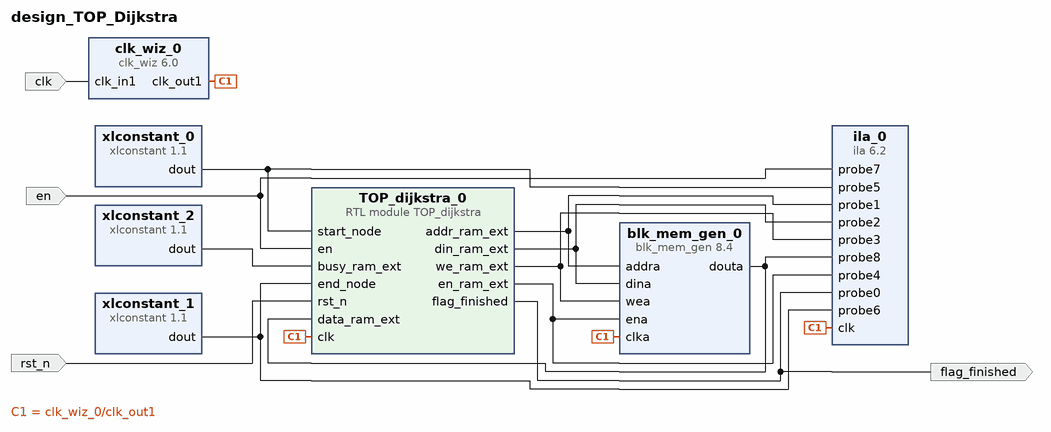
[diagram p0: block diagram of the top level]
# Vivado block design design_TOP_Dijkstra, xc7z020clg400-1, Vivado 2020.2
create_bd_design design_TOP_Dijkstra

create_bd_port -dir I -type clk clk
create_bd_port -dir I en
create_bd_port -dir O flag_finished
create_bd_port -dir I -type rst rst_n

create_bd_cell -type ip -vlnv xilinx.com:ip:blk_mem_gen:8.4 blk_mem_gen_0
set_property -dict [list \
  CONFIG.Enable_32bit_Address false \
  CONFIG.Memory_Type Single_Port_RAM \
  CONFIG.Operating_Mode_A NO_CHANGE \
  CONFIG.Port_A_Write_Rate 50 \
  CONFIG.Port_B_Clock 0 \
  CONFIG.Port_B_Enable_Rate 0 \
  CONFIG.Read_Width_A 16 \
  CONFIG.Register_PortA_Output_of_Memory_Primitives true \
  CONFIG.Use_Byte_Write_Enable false \
  CONFIG.Use_RSTA_Pin false \
  CONFIG.Write_Depth_A 256 \
  CONFIG.Write_Width_A 16 \
  CONFIG.use_bram_block Stand_Alone \
] [get_bd_cells blk_mem_gen_0]
create_bd_cell -type ip -vlnv xilinx.com:ip:xlconstant:1.1 xlconstant_0
set_property -dict {CONFIG.CONST_VAL 1 CONFIG.CONST_WIDTH 5} [get_bd_cells xlconstant_0]
create_bd_cell -type ip -vlnv xilinx.com:ip:xlconstant:1.1 xlconstant_1
set_property -dict {CONFIG.CONST_VAL 17 CONFIG.CONST_WIDTH 5} [get_bd_cells xlconstant_1]
create_bd_cell -type ip -vlnv xilinx.com:ip:ila:6.2 ila_0
set_property -dict [list \
  CONFIG.C_ENABLE_ILA_AXI_MON false \
  CONFIG.C_MONITOR_TYPE Native \
  CONFIG.C_NUM_OF_PROBES 9 \
  CONFIG.C_PROBE5_WIDTH 5 \
  CONFIG.C_PROBE6_WIDTH 5 \
  CONFIG.C_PROBE8_WIDTH 16 \
] [get_bd_cells ila_0]
create_bd_cell -type ip -vlnv xilinx.com:ip:xlconstant:1.1 xlconstant_2
set_property -dict {CONFIG.CONST_VAL 0 CONFIG.CONST_WIDTH 1} [get_bd_cells xlconstant_2]
create_bd_cell -type ip -vlnv xilinx.com:ip:clk_wiz:6.0 clk_wiz_0
set_property -dict [list \
  CONFIG.CLKOUT1_DRIVES BUFG \
  CONFIG.CLKOUT1_JITTER 203.457 \
  CONFIG.CLKOUT1_PHASE_ERROR 155.540 \
  CONFIG.CLKOUT1_REQUESTED_OUT_FREQ 50 \
  CONFIG.CLKOUT2_DRIVES BUFG \
  CONFIG.CLKOUT3_DRIVES BUFG \
  CONFIG.CLKOUT4_DRIVES BUFG \
  CONFIG.CLKOUT5_DRIVES BUFG \
  CONFIG.CLKOUT6_DRIVES BUFG \
  CONFIG.CLKOUT7_DRIVES BUFG \
  CONFIG.JITTER_SEL No_Jitter \
  CONFIG.MMCM_BANDWIDTH OPTIMIZED \
  CONFIG.MMCM_CLKFBOUT_MULT_F 17 \
  CONFIG.MMCM_CLKOUT0_DIVIDE_F 17 \
  CONFIG.MMCM_CLKOUT0_DUTY_CYCLE 0.5 \
  CONFIG.MMCM_COMPENSATION ZHOLD \
  CONFIG.MMCM_DIVCLK_DIVIDE 2 \
  CONFIG.PRIMITIVE PLL \
  CONFIG.RESET_PORT resetn \
  CONFIG.RESET_TYPE ACTIVE_LOW \
  CONFIG.USE_LOCKED false \
  CONFIG.USE_MIN_POWER true \
  CONFIG.USE_RESET false \
] [get_bd_cells clk_wiz_0]
create_bd_cell -type module -reference TOP_dijkstra TOP_dijkstra_0

# ---- connections ----

connect_bd_net -net clk_0_1 [get_bd_pins clk_wiz_0/clk_out1] [get_bd_pins blk_mem_gen_0/clka] [get_bd_pins ila_0/clk] [get_bd_pins TOP_dijkstra_0/clk]
connect_bd_net -net en_0_1 [get_bd_ports en] [get_bd_pins ila_0/probe7] [get_bd_pins TOP_dijkstra_0/en]
connect_bd_net [get_bd_pins TOP_dijkstra_0/flag_finished] [get_bd_ports flag_finished] [get_bd_pins ila_0/probe0]
connect_bd_net -net rst_n_0_1 [get_bd_ports rst_n] [get_bd_pins TOP_dijkstra_0/rst_n]
connect_bd_net [get_bd_pins TOP_dijkstra_0/addr_ram_ext] [get_bd_pins blk_mem_gen_0/addra] [get_bd_pins ila_0/probe1]
connect_bd_net [get_bd_pins TOP_dijkstra_0/din_ram_ext] [get_bd_pins blk_mem_gen_0/dina] [get_bd_pins ila_0/probe2]
connect_bd_net [get_bd_pins TOP_dijkstra_0/we_ram_ext] [get_bd_pins blk_mem_gen_0/wea] [get_bd_pins ila_0/probe3]
connect_bd_net [get_bd_pins TOP_dijkstra_0/en_ram_ext] [get_bd_pins blk_mem_gen_0/ena] [get_bd_pins ila_0/probe4]
connect_bd_net [get_bd_pins xlconstant_0/dout] [get_bd_pins ila_0/probe5] [get_bd_pins TOP_dijkstra_0/start_node]
connect_bd_net [get_bd_pins xlconstant_1/dout] [get_bd_pins ila_0/probe6] [get_bd_pins TOP_dijkstra_0/end_node]
connect_bd_net [get_bd_pins blk_mem_gen_0/douta] [get_bd_pins ila_0/probe8] [get_bd_pins TOP_dijkstra_0/data_ram_ext]
connect_bd_net [get_bd_pins xlconstant_2/dout] [get_bd_pins TOP_dijkstra_0/busy_ram_ext]
connect_bd_net [get_bd_ports clk] [get_bd_pins clk_wiz_0/clk_in1]

validate_bd_design
save_bd_design
